# Altium schematic sheet MPU6050.SchDoc: MPU6050
size A4; Author: SchumyHao; DocumentNumber: 3; Revision: V01; SheetNumber: 3; SheetTotal: 7
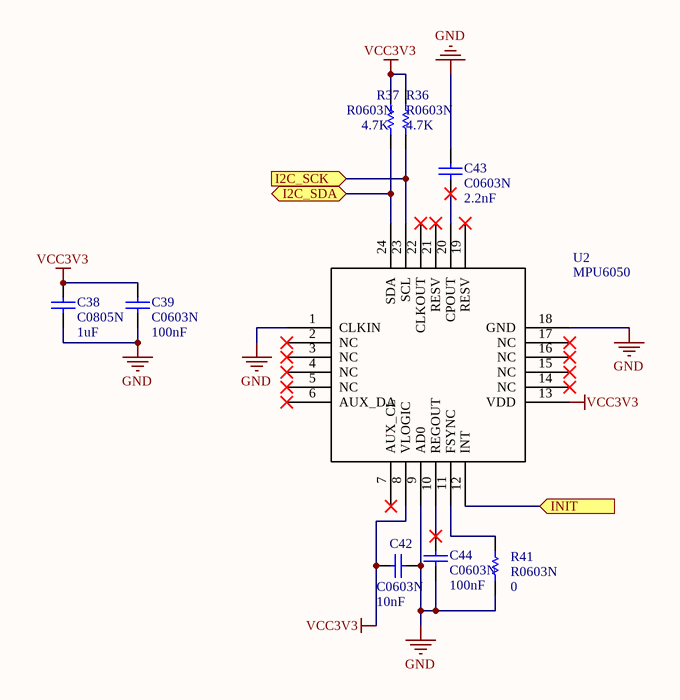
[diagram p0: MPU6050.SchDoc]

## Parts
C38  C0805N  value 1uF  [C0805N]
C39  C0603N  value 100nF  [C0603N]
C42  C0603N  value 10nF  [C0603N]
C43  C0603N  value 2.2nF  [C0603N]
C44  C0603N  value 100nF  [C0603N]
R36  R0603N  value 4.7K  [R0603N]
R37  R0603N  value 4.7K  [R0603N]
R41  R0603N  value 0  [R0603N]
U2  MPU6050  [MPU6050]

## Ports
I2C_SCK (in), I2C_SDA (bidir), INIT (in)

## Nets
GND: C38.1 C39.1 C42.1 C43.2 C44.1 R41.1 U2.1(CLKIN) U2.9(AD0) U2.18(GND)
VCC3V3: C38.2 C39.2 C42.2 R36.2 R37.2 U2.8(VLOGIC) U2.13(VDD)
I2C_SCK: R36.1 U2.23(SCL) ; port I2C_SCK
I2C_SDA: R37.1 U2.24(SDA) ; port I2C_SDA
INIT: U2.12(INT) ; port INIT
NetC43_1: C43.1 U2.20(CPOUT)
NetC44_2: C44.2 U2.10(REGOUT)
NetR41_2: R41.2 U2.11(FSYNC)

Not connected (* = marked no-connect by the designer): U2 2(NC)* 3(NC)* 4(NC)* 5(NC)* 6(AUX_DA)* 7(AUX_CL)* 14(NC)* 15(NC)* 16(NC)* 17(NC)* 19(RESV)* 21(RESV)* 22(CLKOUT)*

## Notes on the sheet
- Title
- Size:
- Date:
- A4
- Number:
- Time:
- Revision:
- Sheet
- of
- File:

## Library data of the parts
C38 C39 C42-C44 = Cap Semi: Capacitor (Semiconductor SIM Model)
R36 R37 R41 = Res Semi: Semiconductor Resistor